# Altium schematic sheet Sh_el_opto_in.SchDoc
size 420 x 297 mm; Address1: Address1; Address2: Address2; Address3: Address3; Address4: Address4; DocumentNumber: АБВГ.123456.001 Э3; SheetNumber: 1; Scale: 1:1; DocumentType: Схема электрическая принципиальная; FirstReferrence: АБВГ.123456.001
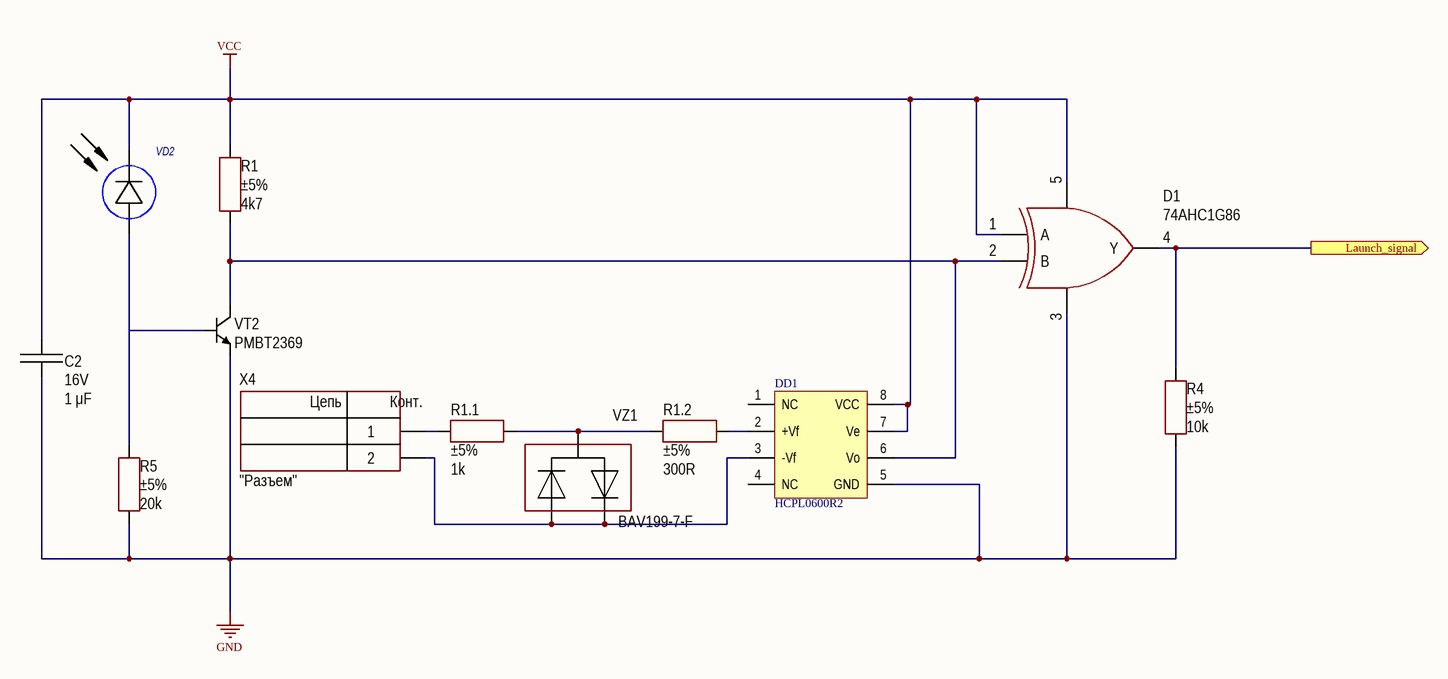
[diagram p0: Sh_el_opto_in.SchDoc]

## Parts
C2  value 1 μF  Voltage: 16V  [CAP: 0805]
D1  PartNumber: 74AHC1G86  [SOT23-5]
DD1  HCPL0600R2  [8-SOIC]
R1  value 4k7  Tolerance: ±5%  [RES: 0805]
R1.1  value 1k  Tolerance: ±5%  [RES: 0805]
R1.2  value 300R  Tolerance: ±5%  [RES: 0805]
R4  value 10k  Tolerance: ±5%  [RES: 0805]
R5  value 20k  Tolerance: ±5%  [RES: 0805]
VD2  SHF250  [LED: SFH757]  (value not drawn)
VT2  PartNumber: PMBT2369  [SOT23]
VZ1  PartNumber: BAV199-7-F  [SOT23]
X4  CommentText: "Разъем"  [CON: KF301-5.0-2P]

## Ports
Launch_signal (out)

## Nets
GND: C2.1 D1.3 DD1.5(GND) R4.1 R5.1 VT2.2(E)
VCC: C2.2 D1.1(A) D1.5 DD1.7(Ve) DD1.8(VCC) R1.2 VD2.2(C)
Launch_signal: D1.4(Y) R4.2 ; port Launch_signal
NetD1_2: D1.2(B) DD1.6(Vo) R1.1 VT2.3(C)
NetDD1_2: DD1.2(+Vf) R1.2.1
NetDD1_3: DD1.3(-Vf) VZ1.1 VZ1.2 X4.2
NetR1.1_1: R1.1.1 R1.2.2 VZ1.3
NetR1.1_2: R1.1.2 X4.1
NetR5_2: R5.2 VD2.1(A) VT2.1(B)

Not connected (* = marked no-connect by the designer): DD1 1(NC) 4(NC)

## Notes on the sheet
- Перв. примен.
- Справ. №
- Подп. и дата
- Инв. № дубл.
- Взам. инв. №
- Разраб.
- Изм.
- Лист
- № докум.
- Подп.
- Дата
- Лит.
- Масса
- Масштаб
- Пров.
- Т.контр.
- Листов
- Инв. № подл.
- Утв.
- Н.контр.
- 2.106-A3
- Копировал
- Формат А3
- (in symbol Connector_terminal_2pin) Цепь; Конт.

## Library data of the parts
C2 = Ceramic_0805: Manufacturer: Yageo; PartNumber: CC0805KRX7R7BB104; ValueManufacturerPartNumber: Ceramic capacitor, 1 μF, X7R, ±10%, 16V, 0805, -55...+125°C; TypeCapacitor: Ceramic capacitor; Tolerance: ±10%; TypeDielectric: X7R; Package: 0805; HelpURL: https://www.digikey.com/product-detail/en/yageo/CC0805KRX7R7BB104/311-1142-1-ND/303052; Temperature: -55...+125°C
D1 = SN74LVC1G86DBVR: XOR; Manufacturer: Texas Instruments; ValueManufacturerPartNumber: IC logic XOR, 1.65...5.5V, -40...+125°C, SOT23-5; Supply: 1.65...5.5V; HelpURL: https://www.digikey.com/product-detail/en/texas-instruments/SN74LVC1G86DBVR/296-9853-1-ND/380077; Package: SOT23-5; ComponentType: IC logic XOR; Temperature: -40...+125°C
R1 = Resistor_0805: Manufacturer: Yageo; PartNumber: RC0805JR-07100RL; ValueManufacturerPartNumber: Resistor film, 4k7, ±5%, 0805, 0.125W, -55...+125°C; TypeResistor: Resistor film; Power: 0.125W; Package: 0805; HelpURL: https://www.digikey.com/product-detail/en/yageo/RC0805JR-07100RL/311-100ARCT-ND/731185; Temperature: -55...+125°C
R1.1 = Resistor_0805: Manufacturer: Yageo; PartNumber: RC0805JR-07100RL; ValueManufacturerPartNumber: Resistor film, 1k, ±5%, 0805, 0.125W, -55...+125°C; TypeResistor: Resistor film; Power: 0.125W; Package: 0805; HelpURL: https://www.digikey.com/product-detail/en/yageo/RC0805JR-07100RL/311-100ARCT-ND/731185; Temperature: -55...+125°C
R1.2 = Resistor_0805: Manufacturer: Yageo; PartNumber: RC0805JR-07100RL; ValueManufacturerPartNumber: Resistor film, 300R, ±5%, 0805, 0.125W, -55...+125°C; TypeResistor: Resistor film; Power: 0.125W; Package: 0805; HelpURL: https://www.digikey.com/product-detail/en/yageo/RC0805JR-07100RL/311-100ARCT-ND/731185; Temperature: -55...+125°C
R4 = Resistor_0805: Manufacturer: Yageo; PartNumber: RC0805JR-07100RL; ValueManufacturerPartNumber: Resistor film, 10k, ±5%, 0805, 0.125W, -55...+125°C; TypeResistor: Resistor film; Power: 0.125W; Package: 0805; HelpURL: https://www.digikey.com/product-detail/en/yageo/RC0805JR-07100RL/311-100ARCT-ND/731185; Temperature: -55...+125°C
R5 = Resistor_0805: Manufacturer: Yageo; PartNumber: RC0805JR-07100RL; ValueManufacturerPartNumber: Resistor film, 20k, ±5%, 0805, 0.125W, -55...+125°C; TypeResistor: Resistor film; Power: 0.125W; Package: 0805; HelpURL: https://www.digikey.com/product-detail/en/yageo/RC0805JR-07100RL/311-100ARCT-ND/731185; Temperature: -55...+125°C
VT2 = BJT_NPN_132: Manufacturer: ON Semiconductor; ValueManufacturerPartNumber: NPN transistor, 45V, 100mA, 100MHz, 300mW, 0.6V, 420, SOT-23, -55...+125°C; TypeTransistor: NPN transistor; VoltageCE: 45V; CurrentCE: 100mA; VoltageSaturation: 0.6V; Frequency: 100MHz; CurrentGain: 420; MaxPower: 300mW; Package: SOT-23; HelpURL: https://www.digikey.com/product-detail/en/on-semiconductor/BC847CLT1G/BC847CLT1GOSCT-ND/917836; Temperature: -55...+125°C
VZ1 = Diode_array: Manufacturer: Diodes Incorporated; ValueManufacturerPartNumber: Diode array, 85V, 140mA, 1.1V, 3us, SOT-23, -65...+150°C; TypeDiode: Diode array; Voltage: 85V; Current: 140mA; VoltageDrop: 1.1V; RecoveryTime: 3us; Package: SOT-23; HelpURL: https://www.digikey.com/product-detail/en/diodes-incorporated/BAV199-7-F/BAV199-FDICT-ND/1033647; Temperature: -65...+150°C
X4 = Connector_terminal_2pin: Manufacturer: Degson; ValueManufacturerPartNumber: Terminal connector, 2pin, 3.5mm, 300VAC, 10A; PartNumber: DG350-3.5-02P-14; TypeConnector: Terminal connector; VoltageMax: 300VAC; Pitch: 3.5mm; CurrentMax: 10A; Multichannel: 2pin; HelpURL: https://www.chipdip.ru/product/dg350-3.5-02p-12
VD2 = SHF250: Model: *; Manufacture: *; HelpURL: *; Case: *